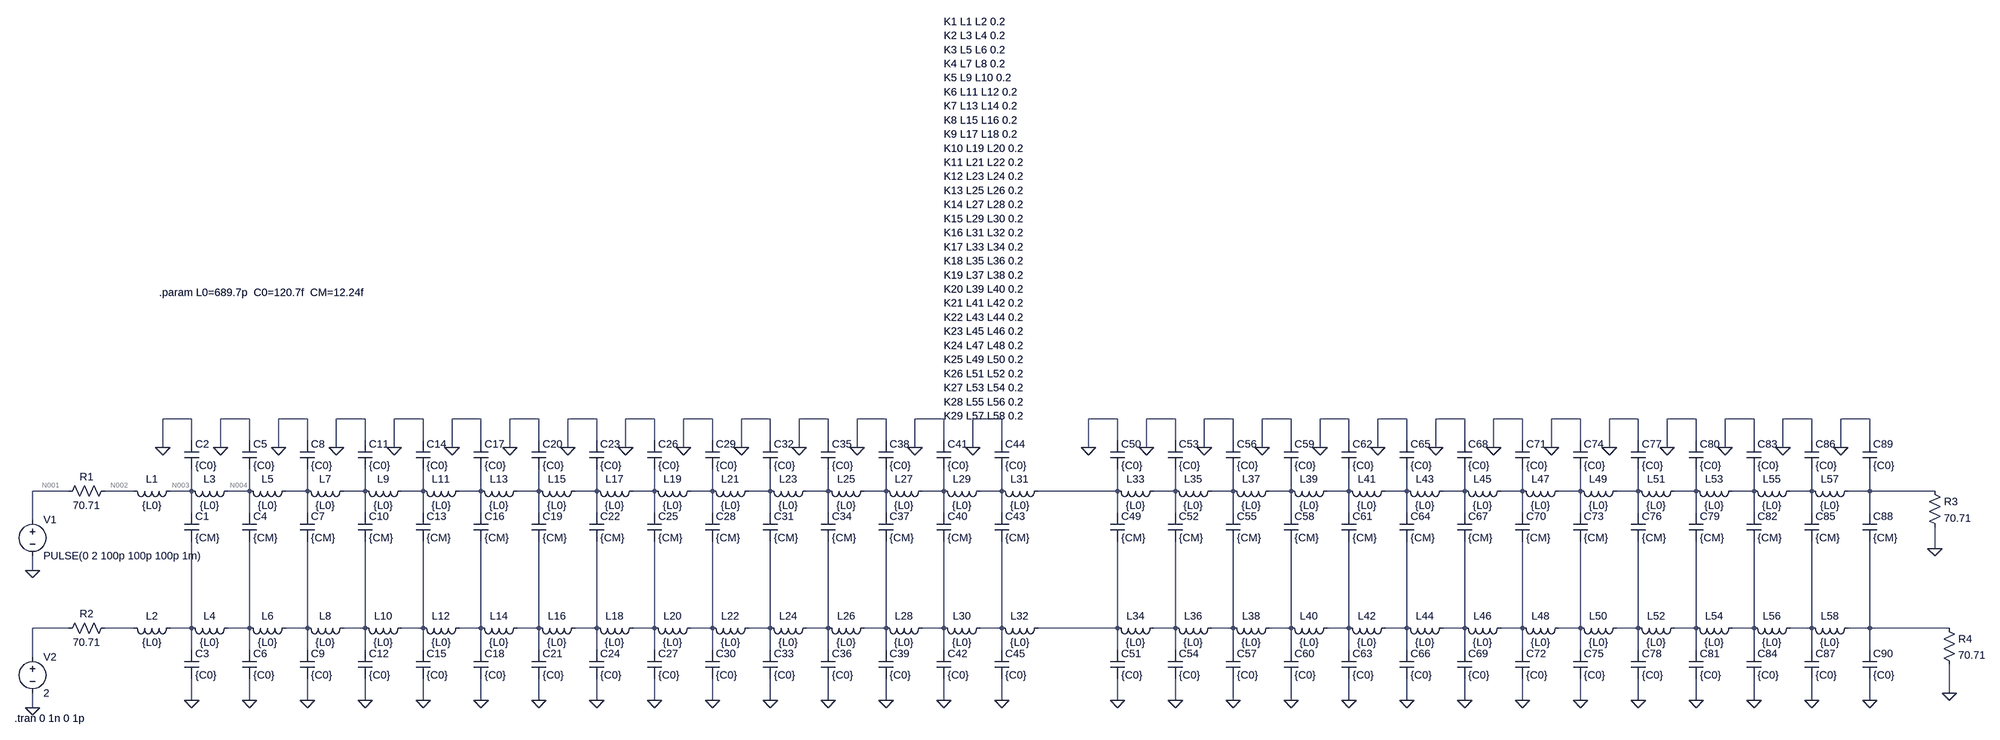
[diagram p0: schematic Exercise3.asc]
Exercise3.asc, the LTspice schematic file:
Version 4.1
SHEET 1 4392 680
WIRE 416 -144 352 -144
WIRE 544 -144 480 -144
WIRE 672 -144 608 -144
WIRE 800 -144 736 -144
WIRE 928 -144 864 -144
WIRE 1056 -144 992 -144
WIRE 1184 -144 1120 -144
WIRE 1312 -144 1248 -144
WIRE 1440 -144 1376 -144
WIRE 1568 -144 1504 -144
WIRE 1696 -144 1632 -144
WIRE 1824 -144 1760 -144
WIRE 1952 -144 1888 -144
WIRE 2080 -144 2016 -144
WIRE 2208 -144 2144 -144
WIRE 2464 -144 2400 -144
WIRE 2592 -144 2528 -144
WIRE 2720 -144 2656 -144
WIRE 2848 -144 2784 -144
WIRE 2976 -144 2912 -144
WIRE 3104 -144 3040 -144
WIRE 3232 -144 3168 -144
WIRE 3360 -144 3296 -144
WIRE 3488 -144 3424 -144
WIRE 3616 -144 3552 -144
WIRE 3744 -144 3680 -144
WIRE 3872 -144 3808 -144
WIRE 4000 -144 3936 -144
WIRE 4128 -144 4064 -144
WIRE 416 -96 416 -144
WIRE 544 -96 544 -144
WIRE 672 -96 672 -144
WIRE 800 -96 800 -144
WIRE 928 -96 928 -144
WIRE 1056 -96 1056 -144
WIRE 1184 -96 1184 -144
WIRE 1312 -96 1312 -144
WIRE 1440 -96 1440 -144
WIRE 1568 -96 1568 -144
WIRE 1696 -96 1696 -144
WIRE 1824 -96 1824 -144
WIRE 1952 -96 1952 -144
WIRE 2080 -96 2080 -144
WIRE 2208 -96 2208 -144
WIRE 2464 -96 2464 -144
WIRE 2592 -96 2592 -144
WIRE 2720 -96 2720 -144
WIRE 2848 -96 2848 -144
WIRE 2976 -96 2976 -144
WIRE 3104 -96 3104 -144
WIRE 3232 -96 3232 -144
WIRE 3360 -96 3360 -144
WIRE 3488 -96 3488 -144
WIRE 3616 -96 3616 -144
WIRE 3744 -96 3744 -144
WIRE 3872 -96 3872 -144
WIRE 4000 -96 4000 -144
WIRE 4128 -96 4128 -144
WIRE 352 -80 352 -144
WIRE 480 -80 480 -144
WIRE 608 -80 608 -144
WIRE 736 -80 736 -144
WIRE 864 -80 864 -144
WIRE 992 -80 992 -144
WIRE 1120 -80 1120 -144
WIRE 1248 -80 1248 -144
WIRE 1376 -80 1376 -144
WIRE 1504 -80 1504 -144
WIRE 1632 -80 1632 -144
WIRE 1760 -80 1760 -144
WIRE 1888 -80 1888 -144
WIRE 2016 -80 2016 -144
WIRE 2144 -80 2144 -144
WIRE 2400 -80 2400 -144
WIRE 2528 -80 2528 -144
WIRE 2656 -80 2656 -144
WIRE 2784 -80 2784 -144
WIRE 2912 -80 2912 -144
WIRE 3040 -80 3040 -144
WIRE 3168 -80 3168 -144
WIRE 3296 -80 3296 -144
WIRE 3424 -80 3424 -144
WIRE 3552 -80 3552 -144
WIRE 3680 -80 3680 -144
WIRE 3808 -80 3808 -144
WIRE 3936 -80 3936 -144
WIRE 4064 -80 4064 -144
WIRE 144 16 64 16
WIRE 288 16 224 16
WIRE 416 16 416 -32
WIRE 416 16 368 16
WIRE 544 16 544 -32
WIRE 544 16 496 16
WIRE 672 16 672 -32
WIRE 672 16 624 16
WIRE 800 16 800 -32
WIRE 800 16 752 16
WIRE 928 16 928 -32
WIRE 928 16 880 16
WIRE 1056 16 1056 -32
WIRE 1056 16 1008 16
WIRE 1184 16 1184 -32
WIRE 1184 16 1136 16
WIRE 1312 16 1312 -32
WIRE 1312 16 1264 16
WIRE 1440 16 1440 -32
WIRE 1440 16 1392 16
WIRE 1568 16 1568 -32
WIRE 1568 16 1520 16
WIRE 1696 16 1696 -32
WIRE 1696 16 1648 16
WIRE 1824 16 1824 -32
WIRE 1824 16 1776 16
WIRE 1952 16 1952 -32
WIRE 1952 16 1904 16
WIRE 2080 16 2080 -32
WIRE 2080 16 2032 16
WIRE 2208 16 2208 -32
WIRE 2208 16 2160 16
WIRE 2464 16 2464 -32
WIRE 2464 16 2288 16
WIRE 2592 16 2592 -32
WIRE 2592 16 2544 16
WIRE 2720 16 2720 -32
WIRE 2720 16 2672 16
WIRE 2848 16 2848 -32
WIRE 2848 16 2800 16
WIRE 2976 16 2976 -32
WIRE 2976 16 2928 16
WIRE 3104 16 3104 -32
WIRE 3104 16 3056 16
WIRE 3232 16 3232 -32
WIRE 3232 16 3184 16
WIRE 3360 16 3360 -32
WIRE 3360 16 3312 16
WIRE 3488 16 3488 -32
WIRE 3488 16 3440 16
WIRE 3616 16 3616 -32
WIRE 3616 16 3568 16
WIRE 3744 16 3744 -32
WIRE 3744 16 3696 16
WIRE 3872 16 3872 -32
WIRE 3872 16 3824 16
WIRE 4000 16 4000 -32
WIRE 4000 16 3952 16
WIRE 4128 16 4128 -32
WIRE 4128 16 4080 16
WIRE 4272 16 4128 16
WIRE 416 64 416 16
WIRE 544 64 544 16
WIRE 672 64 672 16
WIRE 800 64 800 16
WIRE 928 64 928 16
WIRE 1056 64 1056 16
WIRE 1184 64 1184 16
WIRE 1312 64 1312 16
WIRE 1440 64 1440 16
WIRE 1568 64 1568 16
WIRE 1696 64 1696 16
WIRE 1824 64 1824 16
WIRE 1952 64 1952 16
WIRE 2080 64 2080 16
WIRE 2208 64 2208 16
WIRE 2464 64 2464 16
WIRE 2592 64 2592 16
WIRE 2720 64 2720 16
WIRE 2848 64 2848 16
WIRE 2976 64 2976 16
WIRE 3104 64 3104 16
WIRE 3232 64 3232 16
WIRE 3360 64 3360 16
WIRE 3488 64 3488 16
WIRE 3616 64 3616 16
WIRE 3744 64 3744 16
WIRE 3872 64 3872 16
WIRE 4000 64 4000 16
WIRE 4128 64 4128 16
WIRE 64 80 64 16
WIRE 4272 144 4272 96
WIRE 64 192 64 160
WIRE 144 320 64 320
WIRE 288 320 224 320
WIRE 416 320 416 128
WIRE 416 320 368 320
WIRE 544 320 544 128
WIRE 544 320 496 320
WIRE 672 320 672 128
WIRE 672 320 624 320
WIRE 800 320 800 128
WIRE 800 320 752 320
WIRE 928 320 928 128
WIRE 928 320 880 320
WIRE 1056 320 1056 128
WIRE 1056 320 1008 320
WIRE 1184 320 1184 128
WIRE 1184 320 1136 320
WIRE 1312 320 1312 128
WIRE 1312 320 1264 320
WIRE 1440 320 1440 128
WIRE 1440 320 1392 320
WIRE 1568 320 1568 128
WIRE 1568 320 1520 320
WIRE 1696 320 1696 128
WIRE 1696 320 1648 320
WIRE 1824 320 1824 128
WIRE 1824 320 1776 320
WIRE 1952 320 1952 128
WIRE 1952 320 1904 320
WIRE 2080 320 2080 128
WIRE 2080 320 2032 320
WIRE 2208 320 2208 128
WIRE 2208 320 2160 320
WIRE 2464 320 2464 128
WIRE 2464 320 2288 320
WIRE 2592 320 2592 128
WIRE 2592 320 2544 320
WIRE 2720 320 2720 128
WIRE 2720 320 2672 320
WIRE 2848 320 2848 128
WIRE 2848 320 2800 320
WIRE 2976 320 2976 128
WIRE 2976 320 2928 320
WIRE 3104 320 3104 128
WIRE 3104 320 3056 320
WIRE 3232 320 3232 128
WIRE 3232 320 3184 320
WIRE 3360 320 3360 128
WIRE 3360 320 3312 320
WIRE 3488 320 3488 128
WIRE 3488 320 3440 320
WIRE 3616 320 3616 128
WIRE 3616 320 3568 320
WIRE 3744 320 3744 128
WIRE 3744 320 3696 320
WIRE 3872 320 3872 128
WIRE 3872 320 3824 320
WIRE 4000 320 4000 128
WIRE 4000 320 3952 320
WIRE 4128 320 4128 128
WIRE 4128 320 4080 320
WIRE 4304 320 4128 320
WIRE 416 368 416 320
WIRE 544 368 544 320
WIRE 672 368 672 320
WIRE 800 368 800 320
WIRE 928 368 928 320
WIRE 1056 368 1056 320
WIRE 1184 368 1184 320
WIRE 1312 368 1312 320
WIRE 1440 368 1440 320
WIRE 1568 368 1568 320
WIRE 1696 368 1696 320
WIRE 1824 368 1824 320
WIRE 1952 368 1952 320
WIRE 2080 368 2080 320
WIRE 2208 368 2208 320
WIRE 2464 368 2464 320
WIRE 2592 368 2592 320
WIRE 2720 368 2720 320
WIRE 2848 368 2848 320
WIRE 2976 368 2976 320
WIRE 3104 368 3104 320
WIRE 3232 368 3232 320
WIRE 3360 368 3360 320
WIRE 3488 368 3488 320
WIRE 3616 368 3616 320
WIRE 3744 368 3744 320
WIRE 3872 368 3872 320
WIRE 4000 368 4000 320
WIRE 4128 368 4128 320
WIRE 64 384 64 320
WIRE 4304 464 4304 400
WIRE 416 480 416 432
WIRE 544 480 544 432
WIRE 672 480 672 432
WIRE 800 480 800 432
WIRE 928 480 928 432
WIRE 1056 480 1056 432
WIRE 1184 480 1184 432
WIRE 1312 480 1312 432
WIRE 1440 480 1440 432
WIRE 1568 480 1568 432
WIRE 1696 480 1696 432
WIRE 1824 480 1824 432
WIRE 1952 480 1952 432
WIRE 2080 480 2080 432
WIRE 2208 480 2208 432
WIRE 2464 480 2464 432
WIRE 2592 480 2592 432
WIRE 2720 480 2720 432
WIRE 2848 480 2848 432
WIRE 2976 480 2976 432
WIRE 3104 480 3104 432
WIRE 3232 480 3232 432
WIRE 3360 480 3360 432
WIRE 3488 480 3488 432
WIRE 3616 480 3616 432
WIRE 3744 480 3744 432
WIRE 3872 480 3872 432
WIRE 4000 480 4000 432
WIRE 4128 480 4128 432
WIRE 64 496 64 464
FLAG 64 192 0
FLAG 64 496 0
FLAG 352 -80 0
FLAG 416 480 0
FLAG 480 -80 0
FLAG 544 480 0
FLAG 608 -80 0
FLAG 672 480 0
FLAG 736 -80 0
FLAG 800 480 0
FLAG 864 -80 0
FLAG 928 480 0
FLAG 992 -80 0
FLAG 1056 480 0
FLAG 1120 -80 0
FLAG 1184 480 0
FLAG 1248 -80 0
FLAG 1312 480 0
FLAG 1376 -80 0
FLAG 1440 480 0
FLAG 1504 -80 0
FLAG 1568 480 0
FLAG 1632 -80 0
FLAG 1696 480 0
FLAG 1760 -80 0
FLAG 1824 480 0
FLAG 1888 -80 0
FLAG 1952 480 0
FLAG 2016 -80 0
FLAG 2080 480 0
FLAG 2144 -80 0
FLAG 2208 480 0
FLAG 2400 -80 0
FLAG 2464 480 0
FLAG 2528 -80 0
FLAG 2592 480 0
FLAG 2656 -80 0
FLAG 2720 480 0
FLAG 2784 -80 0
FLAG 2848 480 0
FLAG 2912 -80 0
FLAG 2976 480 0
FLAG 3040 -80 0
FLAG 3104 480 0
FLAG 3168 -80 0
FLAG 3232 480 0
FLAG 3296 -80 0
FLAG 3360 480 0
FLAG 3424 -80 0
FLAG 3488 480 0
FLAG 3552 -80 0
FLAG 3616 480 0
FLAG 3680 -80 0
FLAG 3744 480 0
FLAG 3808 -80 0
FLAG 3872 480 0
FLAG 3936 -80 0
FLAG 4000 480 0
FLAG 4064 -80 0
FLAG 4128 480 0
FLAG 4272 144 0
FLAG 4304 464 0
SYMBOL voltage 64 64 R0
WINDOW 123 0 0 Left 0
WINDOW 39 0 0 Left 0
SYMATTR InstName V1
SYMATTR Value PULSE(0 2 100p 100p 100p 1m)
SYMBOL res 240 0 R90
WINDOW 0 0 56 VBottom 2
WINDOW 3 32 56 VTop 2
SYMATTR InstName R1
SYMATTR Value 70.71
SYMBOL ind 384 0 R90
WINDOW 0 5 56 VBottom 2
WINDOW 3 32 56 VTop 2
SYMATTR InstName L1
SYMATTR Value {L0}
SYMATTR Type ind
SYMATTR SpiceLine Rser=1m
SYMBOL cap 400 64 R0
SYMATTR InstName C1
SYMATTR Value {CM}
SYMBOL cap 400 -96 R0
SYMATTR InstName C2
SYMATTR Value {C0}
SYMBOL voltage 64 368 R0
WINDOW 123 0 0 Left 0
WINDOW 39 0 0 Left 0
SYMATTR InstName V2
SYMATTR Value 2
SYMBOL res 240 304 R90
WINDOW 0 0 56 VBottom 2
WINDOW 3 32 56 VTop 2
SYMATTR InstName R2
SYMATTR Value 70.71
SYMBOL ind 384 304 R90
WINDOW 0 5 56 VBottom 2
WINDOW 3 32 56 VTop 2
SYMATTR InstName L2
SYMATTR Value {L0}
SYMATTR Type ind
SYMATTR SpiceLine Rser=1m
SYMBOL cap 400 368 R0
SYMATTR InstName C3
SYMATTR Value {C0}
SYMBOL ind 512 0 R90
WINDOW 0 5 56 VBottom 2
WINDOW 3 32 56 VTop 2
SYMATTR InstName L3
SYMATTR Value {L0}
SYMATTR Type ind
SYMATTR SpiceLine Rser=1m
SYMBOL cap 528 64 R0
SYMATTR InstName C4
SYMATTR Value {CM}
SYMBOL cap 528 -96 R0
SYMATTR InstName C5
SYMATTR Value {C0}
SYMBOL ind 512 304 R90
WINDOW 0 5 56 VBottom 2
WINDOW 3 32 56 VTop 2
SYMATTR InstName L4
SYMATTR Value {L0}
SYMATTR Type ind
SYMATTR SpiceLine Rser=1m
SYMBOL cap 528 368 R0
SYMATTR InstName C6
SYMATTR Value {C0}
SYMBOL ind 640 0 R90
WINDOW 0 5 56 VBottom 2
WINDOW 3 32 56 VTop 2
SYMATTR InstName L5
SYMATTR Value {L0}
SYMATTR Type ind
SYMATTR SpiceLine Rser=1m
SYMBOL cap 656 64 R0
SYMATTR InstName C7
SYMATTR Value {CM}
SYMBOL cap 656 -96 R0
SYMATTR InstName C8
SYMATTR Value {C0}
SYMBOL ind 640 304 R90
WINDOW 0 5 56 VBottom 2
WINDOW 3 32 56 VTop 2
SYMATTR InstName L6
SYMATTR Value {L0}
SYMATTR Type ind
SYMATTR SpiceLine Rser=1m
SYMBOL cap 656 368 R0
SYMATTR InstName C9
SYMATTR Value {C0}
SYMBOL ind 768 0 R90
WINDOW 0 5 56 VBottom 2
WINDOW 3 32 56 VTop 2
SYMATTR InstName L7
SYMATTR Value {L0}
SYMATTR Type ind
SYMATTR SpiceLine Rser=1m
SYMBOL cap 784 64 R0
SYMATTR InstName C10
SYMATTR Value {CM}
SYMBOL cap 784 -96 R0
SYMATTR InstName C11
SYMATTR Value {C0}
SYMBOL ind 768 304 R90
WINDOW 0 5 56 VBottom 2
WINDOW 3 32 56 VTop 2
SYMATTR InstName L8
SYMATTR Value {L0}
SYMATTR Type ind
SYMATTR SpiceLine Rser=1m
SYMBOL cap 784 368 R0
SYMATTR InstName C12
SYMATTR Value {C0}
SYMBOL ind 896 0 R90
WINDOW 0 5 56 VBottom 2
WINDOW 3 32 56 VTop 2
SYMATTR InstName L9
SYMATTR Value {L0}
SYMATTR Type ind
SYMATTR SpiceLine Rser=1m
SYMBOL cap 912 64 R0
SYMATTR InstName C13
SYMATTR Value {CM}
SYMBOL cap 912 -96 R0
SYMATTR InstName C14
SYMATTR Value {C0}
SYMBOL ind 896 304 R90
WINDOW 0 5 56 VBottom 2
WINDOW 3 32 56 VTop 2
SYMATTR InstName L10
SYMATTR Value {L0}
SYMATTR Type ind
SYMATTR SpiceLine Rser=1m
SYMBOL cap 912 368 R0
SYMATTR InstName C15
SYMATTR Value {C0}
SYMBOL ind 1024 0 R90
WINDOW 0 5 56 VBottom 2
WINDOW 3 32 56 VTop 2
SYMATTR InstName L11
SYMATTR Value {L0}
SYMATTR Type ind
SYMATTR SpiceLine Rser=1m
SYMBOL cap 1040 64 R0
SYMATTR InstName C16
SYMATTR Value {CM}
SYMBOL cap 1040 -96 R0
SYMATTR InstName C17
SYMATTR Value {C0}
SYMBOL ind 1024 304 R90
WINDOW 0 5 56 VBottom 2
WINDOW 3 32 56 VTop 2
SYMATTR InstName L12
SYMATTR Value {L0}
SYMATTR Type ind
SYMATTR SpiceLine Rser=1m
SYMBOL cap 1040 368 R0
SYMATTR InstName C18
SYMATTR Value {C0}
SYMBOL ind 1152 0 R90
WINDOW 0 5 56 VBottom 2
WINDOW 3 32 56 VTop 2
SYMATTR InstName L13
SYMATTR Value {L0}
SYMATTR Type ind
SYMATTR SpiceLine Rser=1m
SYMBOL cap 1168 64 R0
SYMATTR InstName C19
SYMATTR Value {CM}
SYMBOL cap 1168 -96 R0
SYMATTR InstName C20
SYMATTR Value {C0}
SYMBOL ind 1152 304 R90
WINDOW 0 5 56 VBottom 2
WINDOW 3 32 56 VTop 2
SYMATTR InstName L14
SYMATTR Value {L0}
SYMATTR Type ind
SYMATTR SpiceLine Rser=1m
SYMBOL cap 1168 368 R0
SYMATTR InstName C21
SYMATTR Value {C0}
SYMBOL ind 1280 0 R90
WINDOW 0 5 56 VBottom 2
WINDOW 3 32 56 VTop 2
SYMATTR InstName L15
SYMATTR Value {L0}
SYMATTR Type ind
SYMATTR SpiceLine Rser=1m
SYMBOL cap 1296 64 R0
SYMATTR InstName C22
SYMATTR Value {CM}
SYMBOL cap 1296 -96 R0
SYMATTR InstName C23
SYMATTR Value {C0}
SYMBOL ind 1280 304 R90
WINDOW 0 5 56 VBottom 2
WINDOW 3 32 56 VTop 2
SYMATTR InstName L16
SYMATTR Value {L0}
SYMATTR Type ind
SYMATTR SpiceLine Rser=1m
SYMBOL cap 1296 368 R0
SYMATTR InstName C24
SYMATTR Value {C0}
SYMBOL ind 1408 0 R90
WINDOW 0 5 56 VBottom 2
WINDOW 3 32 56 VTop 2
SYMATTR InstName L17
SYMATTR Value {L0}
SYMATTR Type ind
SYMATTR SpiceLine Rser=1m
SYMBOL cap 1424 64 R0
SYMATTR InstName C25
SYMATTR Value {CM}
SYMBOL cap 1424 -96 R0
SYMATTR InstName C26
SYMATTR Value {C0}
SYMBOL ind 1408 304 R90
WINDOW 0 5 56 VBottom 2
WINDOW 3 32 56 VTop 2
SYMATTR InstName L18
SYMATTR Value {L0}
SYMATTR Type ind
SYMATTR SpiceLine Rser=1m
SYMBOL cap 1424 368 R0
SYMATTR InstName C27
SYMATTR Value {C0}
SYMBOL ind 1536 0 R90
WINDOW 0 5 56 VBottom 2
WINDOW 3 32 56 VTop 2
SYMATTR InstName L19
SYMATTR Value {L0}
SYMATTR Type ind
SYMATTR SpiceLine Rser=1m
SYMBOL cap 1552 64 R0
SYMATTR InstName C28
SYMATTR Value {CM}
SYMBOL cap 1552 -96 R0
SYMATTR InstName C29
SYMATTR Value {C0}
SYMBOL ind 1536 304 R90
WINDOW 0 5 56 VBottom 2
WINDOW 3 32 56 VTop 2
SYMATTR InstName L20
SYMATTR Value {L0}
SYMATTR Type ind
SYMATTR SpiceLine Rser=1m
SYMBOL cap 1552 368 R0
SYMATTR InstName C30
SYMATTR Value {C0}
SYMBOL ind 1664 0 R90
WINDOW 0 5 56 VBottom 2
WINDOW 3 32 56 VTop 2
SYMATTR InstName L21
SYMATTR Value {L0}
SYMATTR Type ind
SYMATTR SpiceLine Rser=1m
SYMBOL cap 1680 64 R0
SYMATTR InstName C31
SYMATTR Value {CM}
SYMBOL cap 1680 -96 R0
SYMATTR InstName C32
SYMATTR Value {C0}
SYMBOL ind 1664 304 R90
WINDOW 0 5 56 VBottom 2
WINDOW 3 32 56 VTop 2
SYMATTR InstName L22
SYMATTR Value {L0}
SYMATTR Type ind
SYMATTR SpiceLine Rser=1m
SYMBOL cap 1680 368 R0
SYMATTR InstName C33
SYMATTR Value {C0}
SYMBOL ind 1792 0 R90
WINDOW 0 5 56 VBottom 2
WINDOW 3 32 56 VTop 2
SYMATTR InstName L23
SYMATTR Value {L0}
SYMATTR Type ind
SYMATTR SpiceLine Rser=1m
SYMBOL cap 1808 64 R0
SYMATTR InstName C34
SYMATTR Value {CM}
SYMBOL cap 1808 -96 R0
SYMATTR InstName C35
SYMATTR Value {C0}
SYMBOL ind 1792 304 R90
WINDOW 0 5 56 VBottom 2
WINDOW 3 32 56 VTop 2
SYMATTR InstName L24
SYMATTR Value {L0}
SYMATTR Type ind
SYMATTR SpiceLine Rser=1m
SYMBOL cap 1808 368 R0
SYMATTR InstName C36
SYMATTR Value {C0}
SYMBOL ind 1920 0 R90
WINDOW 0 5 56 VBottom 2
WINDOW 3 32 56 VTop 2
SYMATTR InstName L25
SYMATTR Value {L0}
SYMATTR Type ind
SYMATTR SpiceLine Rser=1m
SYMBOL cap 1936 64 R0
SYMATTR InstName C37
SYMATTR Value {CM}
SYMBOL cap 1936 -96 R0
SYMATTR InstName C38
SYMATTR Value {C0}
SYMBOL ind 1920 304 R90
WINDOW 0 5 56 VBottom 2
WINDOW 3 32 56 VTop 2
SYMATTR InstName L26
SYMATTR Value {L0}
SYMATTR Type ind
SYMATTR SpiceLine Rser=1m
SYMBOL cap 1936 368 R0
SYMATTR InstName C39
SYMATTR Value {C0}
SYMBOL ind 2048 0 R90
WINDOW 0 5 56 VBottom 2
WINDOW 3 32 56 VTop 2
SYMATTR InstName L27
SYMATTR Value {L0}
SYMATTR Type ind
SYMATTR SpiceLine Rser=1m
SYMBOL cap 2064 64 R0
SYMATTR InstName C40
SYMATTR Value {CM}
SYMBOL cap 2064 -96 R0
SYMATTR InstName C41
SYMATTR Value {C0}
SYMBOL ind 2048 304 R90
WINDOW 0 5 56 VBottom 2
WINDOW 3 32 56 VTop 2
SYMATTR InstName L28
SYMATTR Value {L0}
SYMATTR Type ind
SYMATTR SpiceLine Rser=1m
SYMBOL cap 2064 368 R0
SYMATTR InstName C42
SYMATTR Value {C0}
SYMBOL ind 2176 0 R90
WINDOW 0 5 56 VBottom 2
WINDOW 3 32 56 VTop 2
SYMATTR InstName L29
SYMATTR Value {L0}
SYMATTR Type ind
SYMATTR SpiceLine Rser=1m
SYMBOL cap 2192 64 R0
SYMATTR InstName C43
SYMATTR Value {CM}
SYMBOL cap 2192 -96 R0
SYMATTR InstName C44
SYMATTR Value {C0}
SYMBOL ind 2176 304 R90
WINDOW 0 5 56 VBottom 2
WINDOW 3 32 56 VTop 2
SYMATTR InstName L30
SYMATTR Value {L0}
SYMATTR Type ind
SYMATTR SpiceLine Rser=1m
SYMBOL cap 2192 368 R0
SYMATTR InstName C45
SYMATTR Value {C0}
SYMBOL ind 2304 0 R90
WINDOW 0 5 56 VBottom 2
WINDOW 3 32 56 VTop 2
SYMATTR InstName L31
SYMATTR Value {L0}
SYMATTR Type ind
SYMATTR SpiceLine Rser=1m
SYMBOL ind 2304 304 R90
WINDOW 0 5 56 VBottom 2
WINDOW 3 32 56 VTop 2
SYMATTR InstName L32
SYMATTR Value {L0}
SYMATTR Type ind
SYMATTR SpiceLine Rser=1m
SYMBOL cap 2448 64 R0
SYMATTR InstName C49
SYMATTR Value {CM}
SYMBOL cap 2448 -96 R0
SYMATTR InstName C50
SYMATTR Value {C0}
SYMBOL cap 2448 368 R0
SYMATTR InstName C51
SYMATTR Value {C0}
SYMBOL ind 2560 0 R90
WINDOW 0 5 56 VBottom 2
WINDOW 3 32 56 VTop 2
SYMATTR InstName L33
SYMATTR Value {L0}
SYMATTR Type ind
SYMATTR SpiceLine Rser=1m
SYMBOL cap 2576 64 R0
SYMATTR InstName C52
SYMATTR Value {CM}
SYMBOL cap 2576 -96 R0
SYMATTR InstName C53
SYMATTR Value {C0}
SYMBOL ind 2560 304 R90
WINDOW 0 5 56 VBottom 2
WINDOW 3 32 56 VTop 2
SYMATTR InstName L34
SYMATTR Value {L0}
SYMATTR Type ind
SYMATTR SpiceLine Rser=1m
SYMBOL cap 2576 368 R0
SYMATTR InstName C54
SYMATTR Value {C0}
SYMBOL ind 2688 0 R90
WINDOW 0 5 56 VBottom 2
WINDOW 3 32 56 VTop 2
SYMATTR InstName L35
SYMATTR Value {L0}
SYMATTR Type ind
SYMATTR SpiceLine Rser=1m
SYMBOL cap 2704 64 R0
SYMATTR InstName C55
SYMATTR Value {CM}
SYMBOL cap 2704 -96 R0
SYMATTR InstName C56
SYMATTR Value {C0}
SYMBOL ind 2688 304 R90
WINDOW 0 5 56 VBottom 2
WINDOW 3 32 56 VTop 2
SYMATTR InstName L36
SYMATTR Value {L0}
SYMATTR Type ind
SYMATTR SpiceLine Rser=1m
SYMBOL cap 2704 368 R0
SYMATTR InstName C57
SYMATTR Value {C0}
SYMBOL ind 2816 0 R90
WINDOW 0 5 56 VBottom 2
WINDOW 3 32 56 VTop 2
SYMATTR InstName L37
SYMATTR Value {L0}
SYMATTR Type ind
SYMATTR SpiceLine Rser=1m
SYMBOL cap 2832 64 R0
SYMATTR InstName C58
SYMATTR Value {CM}
SYMBOL cap 2832 -96 R0
SYMATTR InstName C59
SYMATTR Value {C0}
SYMBOL ind 2816 304 R90
WINDOW 0 5 56 VBottom 2
WINDOW 3 32 56 VTop 2
SYMATTR InstName L38
SYMATTR Value {L0}
SYMATTR Type ind
SYMATTR SpiceLine Rser=1m
SYMBOL cap 2832 368 R0
SYMATTR InstName C60
SYMATTR Value {C0}
SYMBOL ind 2944 0 R90
WINDOW 0 5 56 VBottom 2
WINDOW 3 32 56 VTop 2
SYMATTR InstName L39
SYMATTR Value {L0}
SYMATTR Type ind
SYMATTR SpiceLine Rser=1m
SYMBOL cap 2960 64 R0
SYMATTR InstName C61
SYMATTR Value {CM}
SYMBOL cap 2960 -96 R0
SYMATTR InstName C62
SYMATTR Value {C0}
SYMBOL ind 2944 304 R90
WINDOW 0 5 56 VBottom 2
WINDOW 3 32 56 VTop 2
SYMATTR InstName L40
SYMATTR Value {L0}
SYMATTR Type ind
SYMATTR SpiceLine Rser=1m
SYMBOL cap 2960 368 R0
SYMATTR InstName C63
SYMATTR Value {C0}
SYMBOL ind 3072 0 R90
WINDOW 0 5 56 VBottom 2
WINDOW 3 32 56 VTop 2
SYMATTR InstName L41
SYMATTR Value {L0}
SYMATTR Type ind
SYMATTR SpiceLine Rser=1m
SYMBOL cap 3088 64 R0
SYMATTR InstName C64
SYMATTR Value {CM}
SYMBOL cap 3088 -96 R0
SYMATTR InstName C65
SYMATTR Value {C0}
SYMBOL ind 3072 304 R90
WINDOW 0 5 56 VBottom 2
WINDOW 3 32 56 VTop 2
SYMATTR InstName L42
SYMATTR Value {L0}
SYMATTR Type ind
SYMATTR SpiceLine Rser=1m
SYMBOL cap 3088 368 R0
SYMATTR InstName C66
SYMATTR Value {C0}
SYMBOL ind 3200 0 R90
WINDOW 0 5 56 VBottom 2
WINDOW 3 32 56 VTop 2
SYMATTR InstName L43
SYMATTR Value {L0}
SYMATTR Type ind
SYMATTR SpiceLine Rser=1m
SYMBOL cap 3216 64 R0
SYMATTR InstName C67
SYMATTR Value {CM}
SYMBOL cap 3216 -96 R0
SYMATTR InstName C68
SYMATTR Value {C0}
SYMBOL ind 3200 304 R90
WINDOW 0 5 56 VBottom 2
WINDOW 3 32 56 VTop 2
SYMATTR InstName L44
SYMATTR Value {L0}
SYMATTR Type ind
SYMATTR SpiceLine Rser=1m
SYMBOL cap 3216 368 R0
SYMATTR InstName C69
SYMATTR Value {C0}
SYMBOL ind 3328 0 R90
WINDOW 0 5 56 VBottom 2
WINDOW 3 32 56 VTop 2
SYMATTR InstName L45
SYMATTR Value {L0}
SYMATTR Type ind
SYMATTR SpiceLine Rser=1m
SYMBOL cap 3344 64 R0
SYMATTR InstName C70
SYMATTR Value {CM}
SYMBOL cap 3344 -96 R0
SYMATTR InstName C71
SYMATTR Value {C0}
SYMBOL ind 3328 304 R90
WINDOW 0 5 56 VBottom 2
WINDOW 3 32 56 VTop 2
SYMATTR InstName L46
SYMATTR Value {L0}
SYMATTR Type ind
SYMATTR SpiceLine Rser=1m
SYMBOL cap 3344 368 R0
SYMATTR InstName C72
SYMATTR Value {C0}
SYMBOL ind 3456 0 R90
WINDOW 0 5 56 VBottom 2
WINDOW 3 32 56 VTop 2
SYMATTR InstName L47
SYMATTR Value {L0}
SYMATTR Type ind
SYMATTR SpiceLine Rser=1m
SYMBOL cap 3472 64 R0
SYMATTR InstName C73
SYMATTR Value {CM}
SYMBOL cap 3472 -96 R0
SYMATTR InstName C74
SYMATTR Value {C0}
SYMBOL ind 3456 304 R90
WINDOW 0 5 56 VBottom 2
WINDOW 3 32 56 VTop 2
SYMATTR InstName L48
SYMATTR Value {L0}
SYMATTR Type ind
SYMATTR SpiceLine Rser=1m
SYMBOL cap 3472 368 R0
SYMATTR InstName C75
SYMATTR Value {C0}
SYMBOL ind 3584 0 R90
WINDOW 0 5 56 VBottom 2
WINDOW 3 32 56 VTop 2
SYMATTR InstName L49
SYMATTR Value {L0}
SYMATTR Type ind
SYMATTR SpiceLine Rser=1m
SYMBOL cap 3600 64 R0
SYMATTR InstName C76
SYMATTR Value {CM}
SYMBOL cap 3600 -96 R0
SYMATTR InstName C77
SYMATTR Value {C0}
SYMBOL ind 3584 304 R90
WINDOW 0 5 56 VBottom 2
WINDOW 3 32 56 VTop 2
SYMATTR InstName L50
SYMATTR Value {L0}
SYMATTR Type ind
SYMATTR SpiceLine Rser=1m
SYMBOL cap 3600 368 R0
SYMATTR InstName C78
SYMATTR Value {C0}
SYMBOL ind 3712 0 R90
WINDOW 0 5 56 VBottom 2
WINDOW 3 32 56 VTop 2
SYMATTR InstName L51
SYMATTR Value {L0}
SYMATTR Type ind
SYMATTR SpiceLine Rser=1m
SYMBOL cap 3728 64 R0
SYMATTR InstName C79
SYMATTR Value {CM}
SYMBOL cap 3728 -96 R0
SYMATTR InstName C80
SYMATTR Value {C0}
SYMBOL ind 3712 304 R90
WINDOW 0 5 56 VBottom 2
WINDOW 3 32 56 VTop 2
SYMATTR InstName L52
SYMATTR Value {L0}
SYMATTR Type ind
SYMATTR SpiceLine Rser=1m
SYMBOL cap 3728 368 R0
SYMATTR InstName C81
SYMATTR Value {C0}
SYMBOL ind 3840 0 R90
WINDOW 0 5 56 VBottom 2
WINDOW 3 32 56 VTop 2
SYMATTR InstName L53
SYMATTR Value {L0}
SYMATTR Type ind
SYMATTR SpiceLine Rser=1m
SYMBOL cap 3856 64 R0
SYMATTR InstName C82
SYMATTR Value {CM}
SYMBOL cap 3856 -96 R0
SYMATTR InstName C83
SYMATTR Value {C0}
SYMBOL ind 3840 304 R90
WINDOW 0 5 56 VBottom 2
WINDOW 3 32 56 VTop 2
SYMATTR InstName L54
SYMATTR Value {L0}
SYMATTR Type ind
SYMATTR SpiceLine Rser=1m
SYMBOL cap 3856 368 R0
SYMATTR InstName C84
SYMATTR Value {C0}
SYMBOL ind 3968 0 R90
WINDOW 0 5 56 VBottom 2
WINDOW 3 32 56 VTop 2
SYMATTR InstName L55
SYMATTR Value {L0}
SYMATTR Type ind
SYMATTR SpiceLine Rser=1m
SYMBOL cap 3984 64 R0
SYMATTR InstName C85
SYMATTR Value {CM}
SYMBOL cap 3984 -96 R0
SYMATTR InstName C86
SYMATTR Value {C0}
SYMBOL ind 3968 304 R90
WINDOW 0 5 56 VBottom 2
WINDOW 3 32 56 VTop 2
SYMATTR InstName L56
SYMATTR Value {L0}
SYMATTR Type ind
SYMATTR SpiceLine Rser=1m
SYMBOL cap 3984 368 R0
SYMATTR InstName C87
SYMATTR Value {C0}
SYMBOL ind 4096 0 R90
WINDOW 0 5 56 VBottom 2
WINDOW 3 32 56 VTop 2
SYMATTR InstName L57
SYMATTR Value {L0}
SYMATTR Type ind
SYMATTR SpiceLine Rser=1m
SYMBOL cap 4112 64 R0
SYMATTR InstName C88
SYMATTR Value {CM}
SYMBOL cap 4112 -96 R0
SYMATTR InstName C89
SYMATTR Value {C0}
SYMBOL ind 4096 304 R90
WINDOW 0 5 56 VBottom 2
WINDOW 3 32 56 VTop 2
SYMATTR InstName L58
SYMATTR Value {L0}
SYMATTR Type ind
SYMATTR SpiceLine Rser=1m
SYMBOL cap 4112 368 R0
SYMATTR InstName C90
SYMATTR Value {C0}
SYMBOL res 4256 0 R0
SYMATTR InstName R3
SYMATTR Value 70.71
SYMBOL res 4288 304 R0
SYMATTR InstName R4
SYMATTR Value 70.71
TEXT 344 -424 Left 2 !.param L0=689.7p  C0=120.7f  CM=12.24f
TEXT 24 520 Left 2 !.tran 0 1n 0 1p
TEXT 2080 -1024 Left 2 !K1 L1 L2 0.2\nK2 L3 L4 0.2\nK3 L5 L6 0.2\nK4 L7 L8 0.2\nK5 L9 L10 0.2\nK6 L11 L12 0.2\nK7 L13 L14 0.2\nK8 L15 L16 0.2\nK9 L17 L18 0.2\nK10 L19 L20 0.2\nK11 L21 L22 0.2\nK12 L23 L24 0.2\nK13 L25 L26 0.2\nK14 L27 L28 0.2\nK15 L29 L30 0.2\nK16 L31 L32 0.2\nK17 L33 L34 0.2\nK18 L35 L36 0.2\nK19 L37 L38 0.2\nK20 L39 L40 0.2\nK21 L41 L42 0.2\nK22 L43 L44 0.2\nK23 L45 L46 0.2\nK24 L47 L48 0.2\nK25 L49 L50 0.2\nK26 L51 L52 0.2\nK27 L53 L54 0.2\nK28 L55 L56 0.2\nK29 L57 L58 0.2

The netlist it stands for:
* Exercise3.asc
V1 N001 0 PULSE(0 2 100p 100p 100p 1m)
R1 N002 N001 70.71
L1 N003 N002 {L0} Rser=1m
C1 N003 N034 {CM}
C2 0 N003 {C0}
V2 N032 0 2
R2 N033 N032 70.71
L2 N034 N033 {L0} Rser=1m
C3 N034 0 {C0}
L3 N004 N003 {L0} Rser=1m
C4 N004 N035 {CM}
C5 0 N004 {C0}
L4 N035 N034 {L0} Rser=1m
C6 N035 0 {C0}
L5 N005 N004 {L0} Rser=1m
C7 N005 N036 {CM}
C8 0 N005 {C0}
L6 N036 N035 {L0} Rser=1m
C9 N036 0 {C0}
L7 N006 N005 {L0} Rser=1m
C10 N006 N037 {CM}
C11 0 N006 {C0}
L8 N037 N036 {L0} Rser=1m
C12 N037 0 {C0}
L9 N007 N006 {L0} Rser=1m
C13 N007 N038 {CM}
C14 0 N007 {C0}
L10 N038 N037 {L0} Rser=1m
C15 N038 0 {C0}
L11 N008 N007 {L0} Rser=1m
C16 N008 N039 {CM}
C17 0 N008 {C0}
L12 N039 N038 {L0} Rser=1m
C18 N039 0 {C0}
L13 N009 N008 {L0} Rser=1m
C19 N009 N040 {CM}
C20 0 N009 {C0}
L14 N040 N039 {L0} Rser=1m
C21 N040 0 {C0}
L15 N010 N009 {L0} Rser=1m
C22 N010 N041 {CM}
C23 0 N010 {C0}
L16 N041 N040 {L0} Rser=1m
C24 N041 0 {C0}
L17 N011 N010 {L0} Rser=1m
C25 N011 N042 {CM}
C26 0 N011 {C0}
L18 N042 N041 {L0} Rser=1m
C27 N042 0 {C0}
L19 N012 N011 {L0} Rser=1m
C28 N012 N043 {CM}
C29 0 N012 {C0}
L20 N043 N042 {L0} Rser=1m
C30 N043 0 {C0}
L21 N013 N012 {L0} Rser=1m
C31 N013 N044 {CM}
C32 0 N013 {C0}
L22 N044 N043 {L0} Rser=1m
C33 N044 0 {C0}
L23 N014 N013 {L0} Rser=1m
C34 N014 N045 {CM}
C35 0 N014 {C0}
L24 N045 N044 {L0} Rser=1m
C36 N045 0 {C0}
L25 N015 N014 {L0} Rser=1m
C37 N015 N046 {CM}
C38 0 N015 {C0}
L26 N046 N045 {L0} Rser=1m
C39 N046 0 {C0}
L27 N016 N015 {L0} Rser=1m
C40 N016 N047 {CM}
C41 0 N016 {C0}
L28 N047 N046 {L0} Rser=1m
C42 N047 0 {C0}
L29 N017 N016 {L0} Rser=1m
C43 N017 N048 {CM}
C44 0 N017 {C0}
L30 N048 N047 {L0} Rser=1m
C45 N048 0 {C0}
L31 N018 N017 {L0} Rser=1m
L32 N049 N048 {L0} Rser=1m
C49 N018 N049 {CM}
C50 0 N018 {C0}
C51 N049 0 {C0}
L33 N019 N018 {L0} Rser=1m
C52 N019 N050 {CM}
C53 0 N019 {C0}
L34 N050 N049 {L0} Rser=1m
C54 N050 0 {C0}
L35 N020 N019 {L0} Rser=1m
C55 N020 N051 {CM}
C56 0 N020 {C0}
L36 N051 N050 {L0} Rser=1m
C57 N051 0 {C0}
L37 N021 N020 {L0} Rser=1m
C58 N021 N052 {CM}
C59 0 N021 {C0}
L38 N052 N051 {L0} Rser=1m
C60 N052 0 {C0}
L39 N022 N021 {L0} Rser=1m
C61 N022 N053 {CM}
C62 0 N022 {C0}
L40 N053 N052 {L0} Rser=1m
C63 N053 0 {C0}
L41 N023 N022 {L0} Rser=1m
C64 N023 N054 {CM}
C65 0 N023 {C0}
L42 N054 N053 {L0} Rser=1m
C66 N054 0 {C0}
L43 N024 N023 {L0} Rser=1m
C67 N024 N055 {CM}
C68 0 N024 {C0}
L44 N055 N054 {L0} Rser=1m
C69 N055 0 {C0}
L45 N025 N024 {L0} Rser=1m
C70 N025 N056 {CM}
C71 0 N025 {C0}
L46 N056 N055 {L0} Rser=1m
C72 N056 0 {C0}
L47 N026 N025 {L0} Rser=1m
C73 N026 N057 {CM}
C74 0 N026 {C0}
L48 N057 N056 {L0} Rser=1m
C75 N057 0 {C0}
L49 N027 N026 {L0} Rser=1m
C76 N027 N058 {CM}
C77 0 N027 {C0}
L50 N058 N057 {L0} Rser=1m
C78 N058 0 {C0}
L51 N028 N027 {L0} Rser=1m
C79 N028 N059 {CM}
C80 0 N028 {C0}
L52 N059 N058 {L0} Rser=1m
C81 N059 0 {C0}
L53 N029 N028 {L0} Rser=1m
C82 N029 N060 {CM}
C83 0 N029 {C0}
L54 N060 N059 {L0} Rser=1m
C84 N060 0 {C0}
L55 N030 N029 {L0} Rser=1m
C85 N030 N061 {CM}
C86 0 N030 {C0}
L56 N061 N060 {L0} Rser=1m
C87 N061 0 {C0}
L57 N031 N030 {L0} Rser=1m
C88 N031 N062 {CM}
C89 0 N031 {C0}
L58 N062 N061 {L0} Rser=1m
C90 N062 0 {C0}
R3 N031 0 70.71
R4 N062 0 70.71
.param L0=689.7p  C0=120.7f  CM=12.24f
.tran 0 1n 0 1p
K1 L1 L2 0.2
K2 L3 L4 0.2
K3 L5 L6 0.2
K4 L7 L8 0.2
K5 L9 L10 0.2
K6 L11 L12 0.2
K7 L13 L14 0.2
K8 L15 L16 0.2
K9 L17 L18 0.2
K10 L19 L20 0.2
K11 L21 L22 0.2
K12 L23 L24 0.2
K13 L25 L26 0.2
K14 L27 L28 0.2
K15 L29 L30 0.2
K16 L31 L32 0.2
K17 L33 L34 0.2
K18 L35 L36 0.2
K19 L37 L38 0.2
K20 L39 L40 0.2
K21 L41 L42 0.2
K22 L43 L44 0.2
K23 L45 L46 0.2
K24 L47 L48 0.2
K25 L49 L50 0.2
K26 L51 L52 0.2
K27 L53 L54 0.2
K28 L55 L56 0.2
K29 L57 L58 0.2
.backanno
.end

* Results of the author's LTspice run, read from the files saved beside the schematic
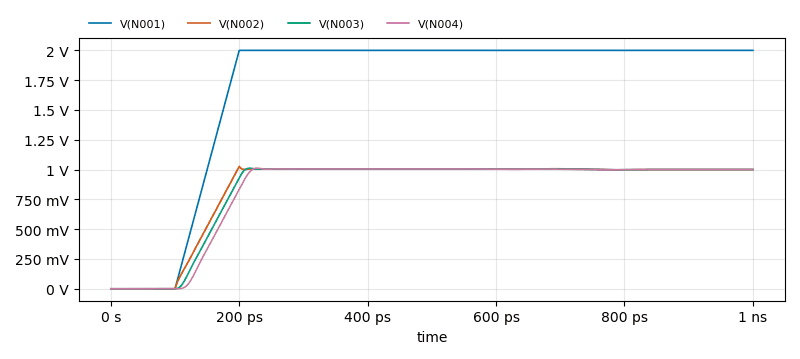
[diagram p1: Transient Analysis of Exercise3.asc, plotted from the saved traces]
* Transient Analysis, 1 run:
*   V(N001): min 0 V, max 2 V, average 1.7 V, rms 1.826 V, last 2 V
*   V(N002): min 0 V, max 1.026 V, average 855.2 mV, rms 917.4 mV, last 1 V
*   V(N003): min 0 V, max 1.011 V, average 845.4 mV, rms 911.8 mV, last 1 V
*   V(N004): min 0 V, max 1.012 V, average 835.7 mV, rms 906.3 mV, last 1 V